# Altium schematic sheet Peripherals_Main_Board.SchDoc
size A3; Organization: Altium Limited; Address1: L3, 12a Rodborough Rd; Address2: Frenchs Forest; Address3: NSW; Address4: Australia 2086; DocumentNumber: 4; SheetNumber: 4; SheetTotal: 8
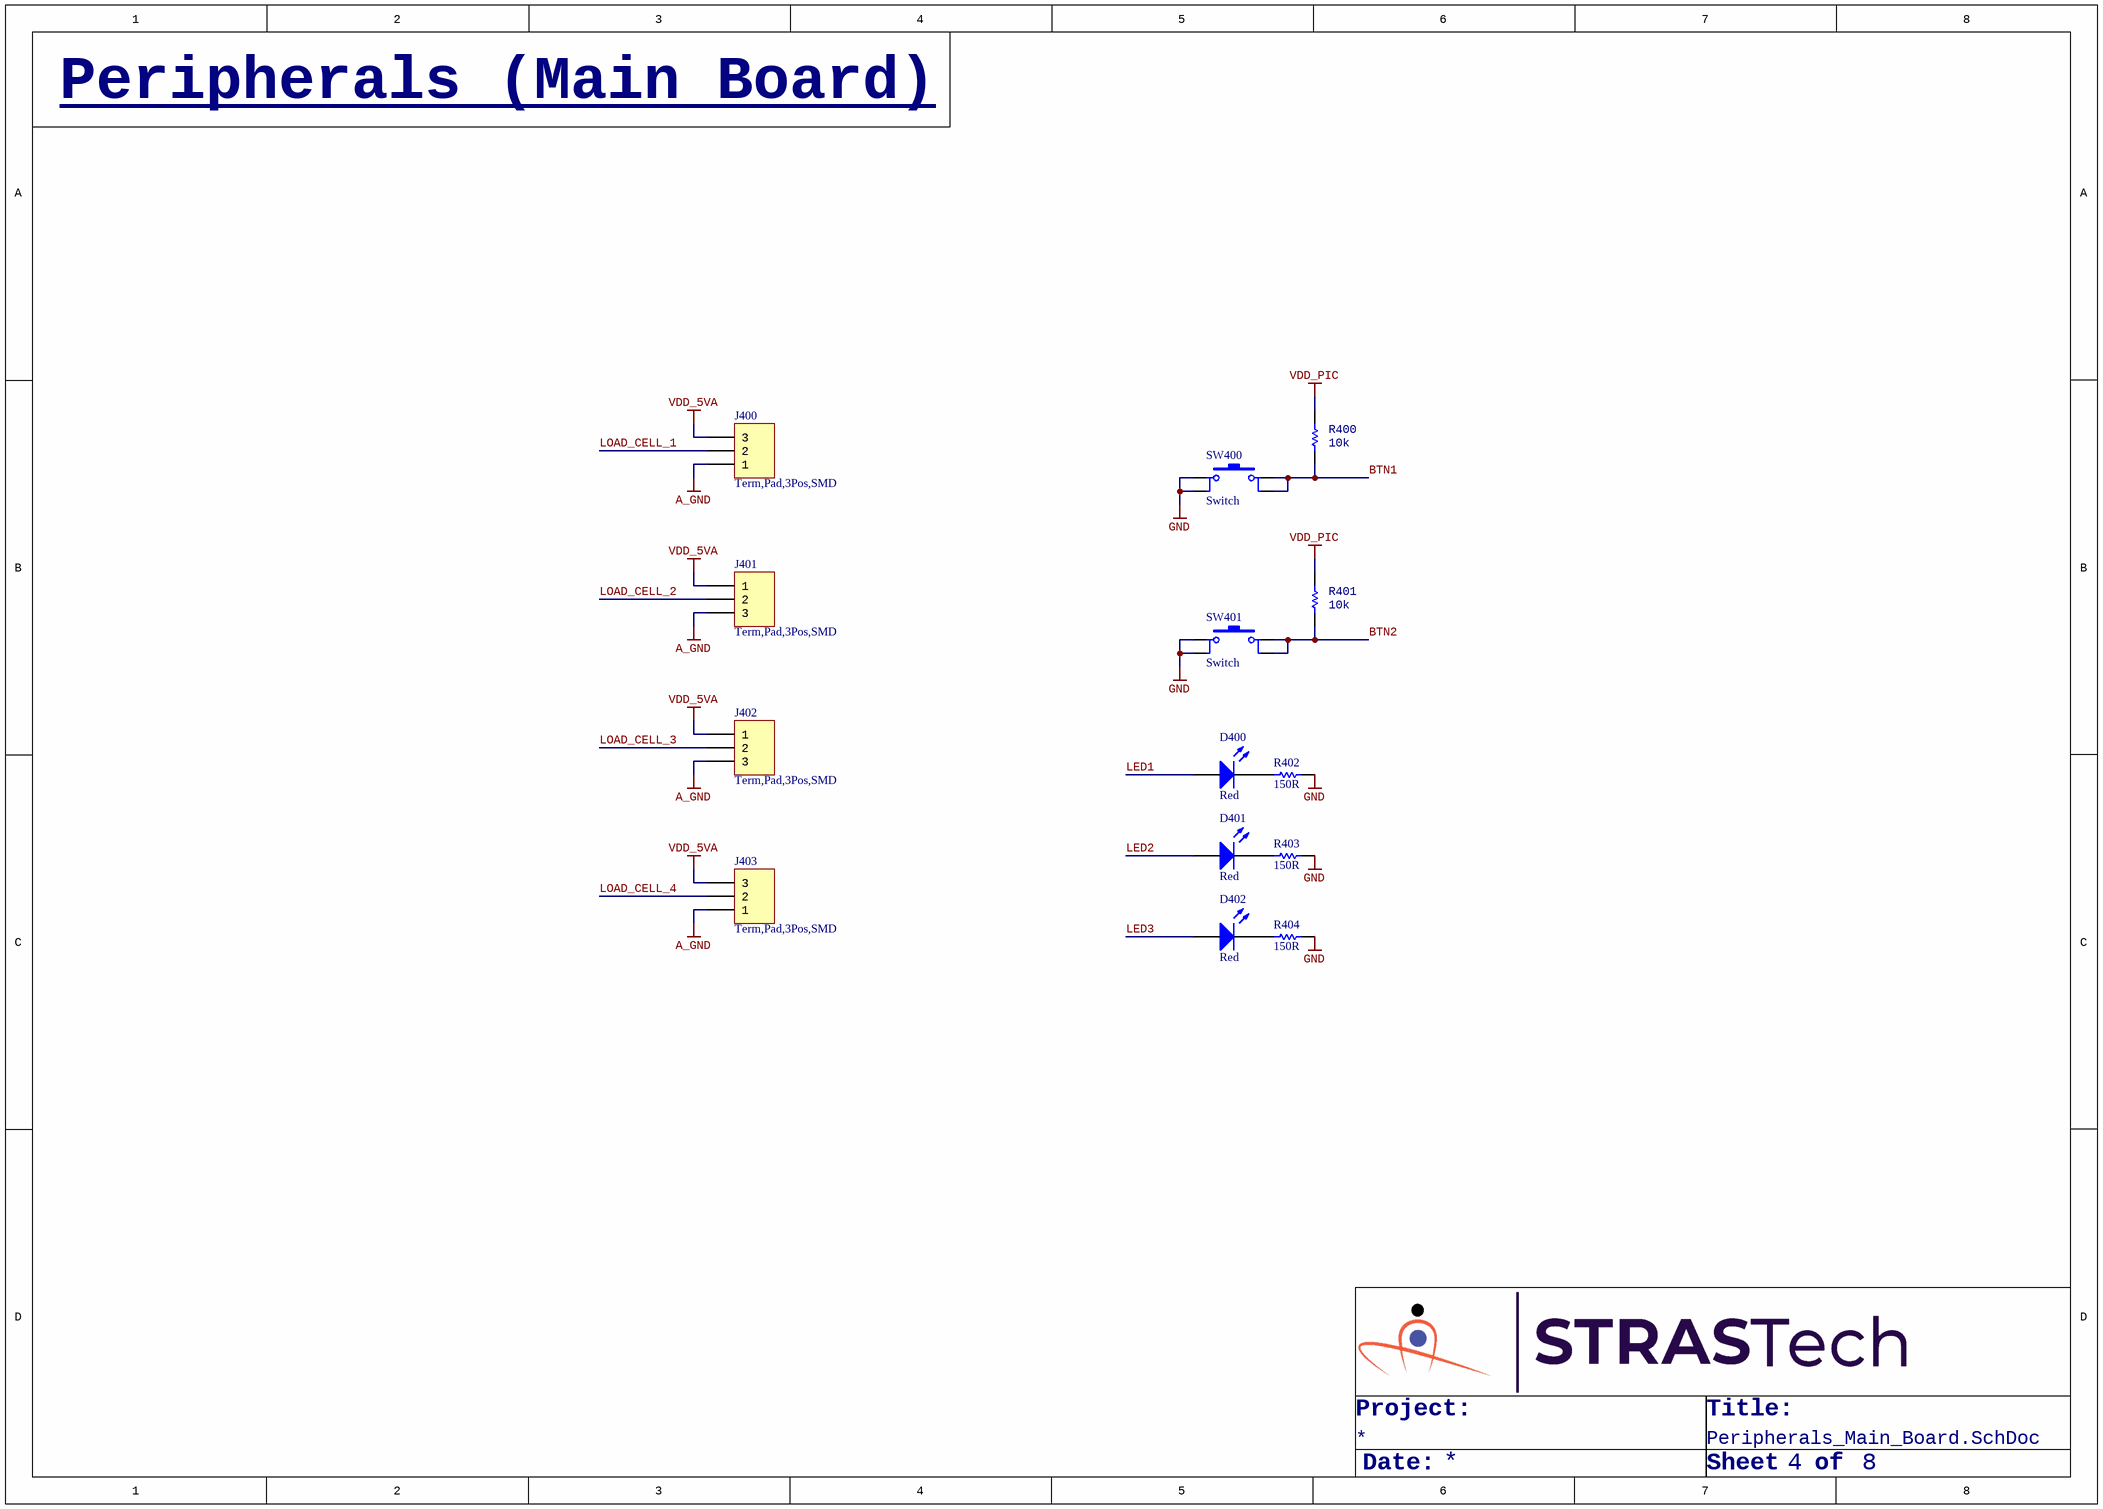
[diagram p0: Peripherals_Main_Board.SchDoc]

## Parts
D400  Red  [LED,5mm,Thru]
D401  Red  [LED,5mm,Thru]
D402  Red  [LED,5mm,Thru]
J400  Term,Pad,3Pos,SMD  [Term,Pad,3Pos,SMD]
J401  Term,Pad,3Pos,SMD  [Term,Pad,3Pos,SMD]
J402  Term,Pad,3Pos,SMD  [Term,Pad,3Pos,SMD]
J403  Term,Pad,3Pos,SMD  [Term,Pad,3Pos,SMD]
R400  10k  [RES,0402]
R401  10k  [RES,0402]
R402  150R  [RES,0402]
R403  150R  [RES,0402]
R404  150R  [RES,0402]
SW400  Switch  [Switch,Tactile,SPST-NO,SMD]
SW401  Switch  [Switch,Tactile,SPST-NO,SMD]

## Nets
A_GND: J400.1 J401.3 J402.3 J403.1
GND: R402.2 R403.2 R404.2 SW400.1 SW400.2 SW401.1 SW401.2
VDD_5VA: J400.3 J401.1 J402.1 J403.3
VDD_PIC: R400.1 R401.1
BTN1: R400.2 SW400.3 SW400.4
BTN2: R401.2 SW401.3 SW401.4
LED1: D400.1(A)
LED2: D401.1(A)
LED3: D402.1(A)
LOAD_CELL_1: J400.2
LOAD_CELL_2: J401.2
LOAD_CELL_3: J402.2
LOAD_CELL_4: J403.2
NetD400_2: D400.2(K) R402.1
NetD401_2: D401.2(K) R403.1
NetD402_2: D402.2(K) R404.1

## Notes on the sheet
- Peripherals (Main Board)
- Project:
- Title:
- Date:
- Sheet
- of
- Title
- Size:
- A3
- Revision:
- Design By:

## Library data of the parts
D400-D402 = LED,Red,5mm,Thru: Red 623nm LED Indication - Discrete 2V Radial; Manufacturer: TT Electronics/Optek Technology; Manufacturer Part Number: OVLFR3C7; Vendor Part Number: 365-1182-ND; Vendor: Digikey; CreatedBy: Judd Foster; HelpURL: https://www.ttelectronics.com/TTElectronics/media/ProductFiles/Datasheets/OVLFx3C7.pdf
J400-J403 = Term,Pad,3Pos,SMD: SMD pads for soldering wires with strain relief; Vendor: N/A; Vendor Part Number: N/A; HelpURL: N/A; Manufacturer: N/A; Manufacturer Part Number: N/A; Created By: Judd Foster
R400 R401 = RES,10k,5%,0.063W,0402: 10 kOhms ±5% 0.063W, 1/16W Chip Resistor 0402 (1005 Metric) Automotive AEC-Q200 Thick Film; Vendor Part Number: RMCF0402JT10K0CT-ND; Manufacturer: Stackpole Electronics Inc; Manufacturer Part Number: RMCF0402JT10K0; Vendor: DIgikey; HelpURL: https://www.seielect.com/catalog/sei-rmcf_rmcp.pdf; CreatedBy: Judd Foster
R402-R404 = RES,150R,1%,0.1W,0402: 150 Ohms ±1% 0.063W, 1/16W Chip Resistor 0402 (1005 Metric) Automotive AEC-Q200, Moisture Resistant Thick Film; Manufacturer: TE Connectivity Passive Product; Manufacturer Part Number: CRGCQ0402F150R; Vendor Part Number: A129617CT-ND; Vendor: Digikey; CreatedBy: Judd Foster; HelpURL: https://www.te.com/commerce/DocumentDelivery/DDEController?Action=srchrtrv&DocNm=1773204-3&DocType=DS&DocLang=English
SW400 SW401 = Switch,Tactile,SPST-NO,SMD,H5.0: Tactile Switch SPST-NO Top Actuated Surface Mount; Manufacturer: C&K; Manufacturer Part Number: PTS645SK50SMTR92 LFS; Vendor Part Number: CKN9087CT-ND; Vendor: Digikey; CreatedBy: Judd Foster; HelpURL: https://dznh3ojzb2azq.cloudfront.net/products/Tactile/PTS645/documents/datasheet.pdf